# EAGLE schematic Schematic_rtpMIDI (EAGLE 7.6.0)
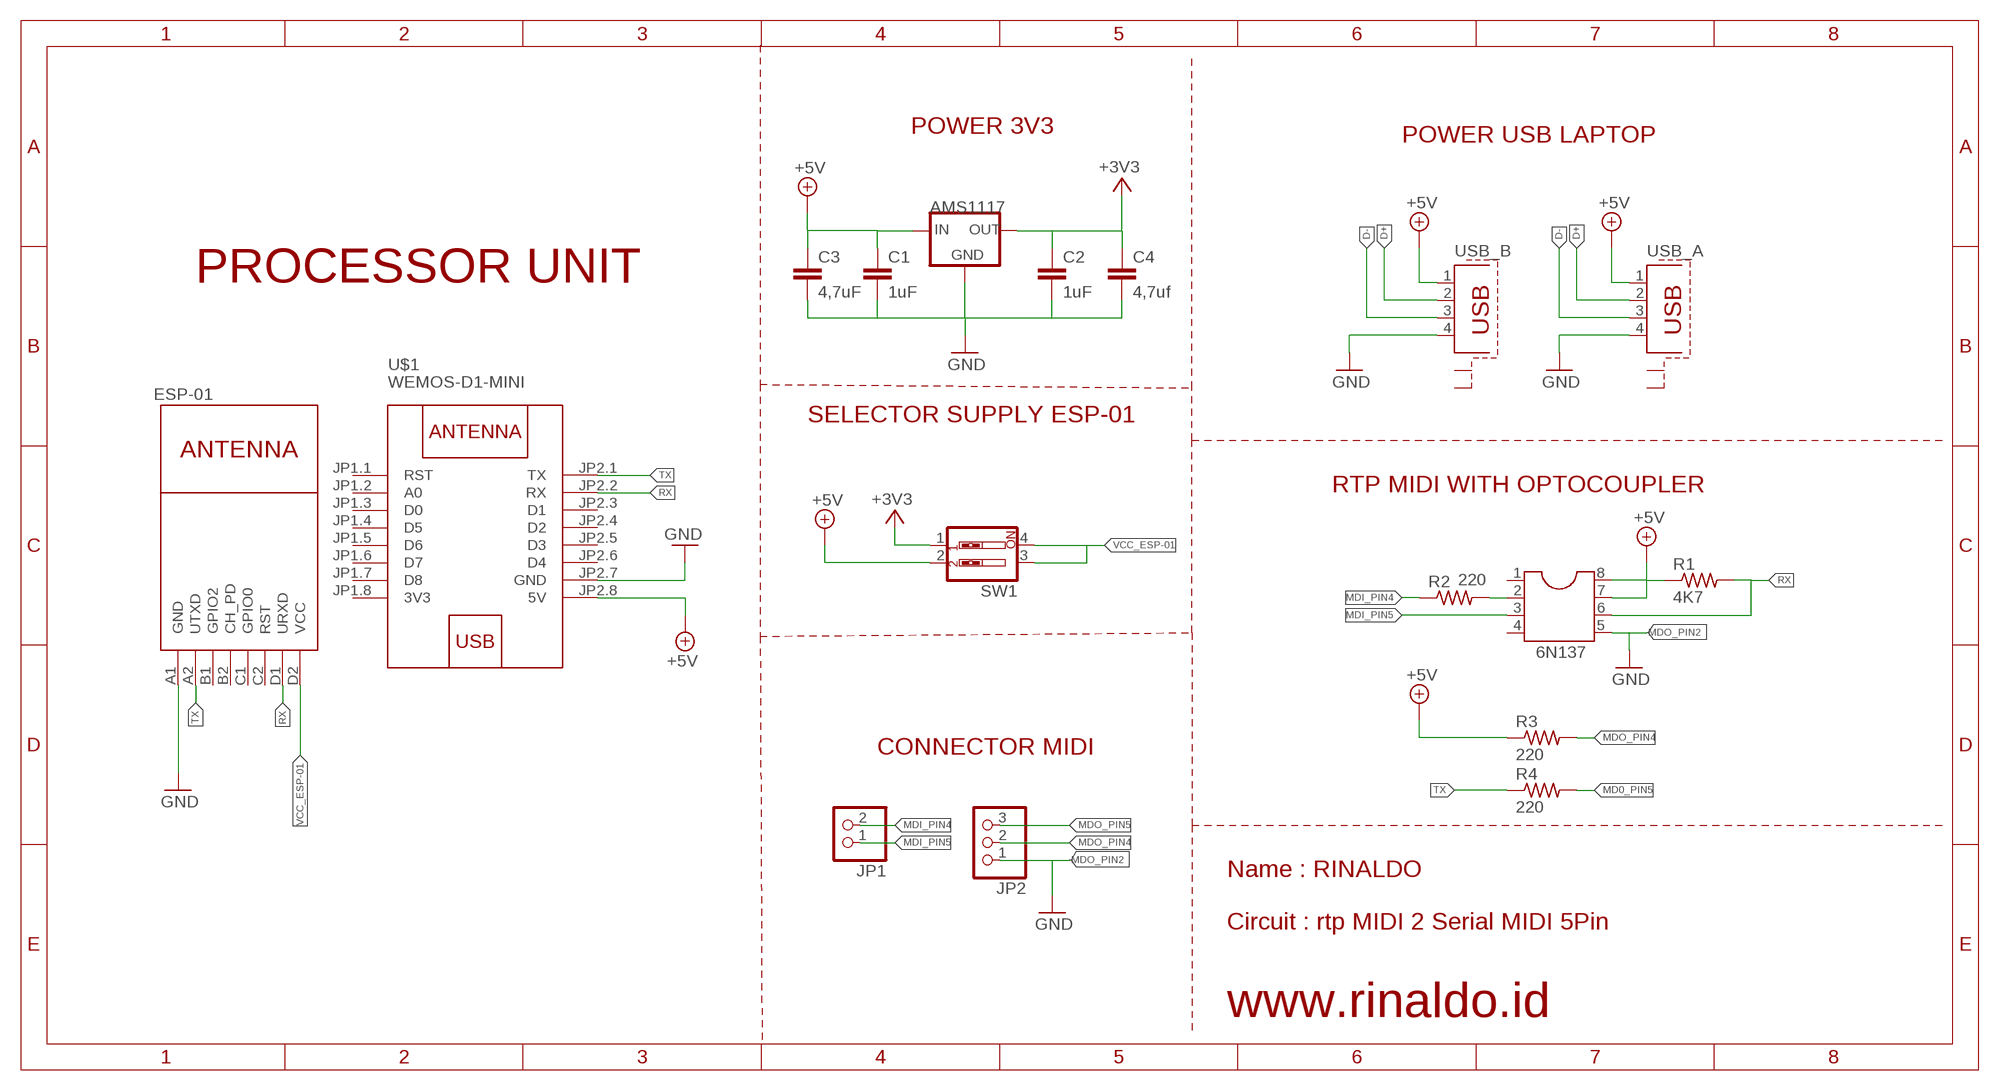
[diagram p0: schematic, sheet 1]

## Parts
6N137  DIL8S  [SOCKET-08]
AMS1117  V_REG_LD1117VXXLD1117-SMD  [SOT223]
C1  1uF  C-EUC0805  [C0805]
C2  1uF  C-EUC0805  [C0805]
C3  4,7uF  C-EUC0805  [C0805]
C4  4,7uf  C-EUC0805  [C0805]
ESP-01  WIRELESS-WIFI-ESP-01  [WIRELESS-WIFI-ESP-01]
JP1  PINHD-1X2  [1X02]
JP2  PINHD-1X3  [1X03]
R1  4K7  R-US_M0805  [M0805]
R2  220  R-US_M0805  [M0805]
R3  220  R-US_M0805  [M0805]
R4  220  R-US_M0805  [M0805]
SW1  SW_DIP-2  [EDG-02]
U$1  WEMOS-D1-MINI  [WEMOS-D1-MINI]
USB_A  PN87520-S  [PN87520-S]
USB_B  PN61729-S  [PN61729-S]

## Nets
+3V3: AMS1117.2(OUT) C2.1 C4.1 SW1.1
+5V: 6N137.7 6N137.8 AMS1117.3(IN) C1.1 C3.1 R1.1 R3.1 SW1.2 U$1.JP2.8(5V) USB_A.1 USB_B.1
D+: USB_A.2 USB_B.2
D-: USB_A.3 USB_B.3
GND: 6N137.5 AMS1117.1(GND) C1.2 C2.2 C3.2 C4.2 ESP-01.A1(GND) JP2.1 U$1.JP2.7(GND) USB_A.4 USB_B.4
MD0_PIN5: R4.2
MDI_PIN4: JP1.2 R2.1
MDI_PIN5: 6N137.3 JP1.1
MDO_PIN4: JP2.2 R3.2
MDO_PIN5: JP2.3
N$1: 6N137.2 R2.2
RX: 6N137.6 ESP-01.D1(URXD) R1.2 U$1.JP2.2(RX)
TX: ESP-01.A2(UTXD) R4.1 U$1.JP2.1(TX)
VCC_ESP-01: ESP-01.D2(VCC) SW1.3 SW1.4
Unconnected: 6N137.1 6N137.4 ESP-01.B1(GPIO2) ESP-01.B2(CH_PD) ESP-01.C1(GPIO0) ESP-01.C2(RST) U$1.JP1.1(RST) U$1.JP1.2(A0) U$1.JP1.3(D0) U$1.JP1.4(D5) U$1.JP1.5(D6) U$1.JP1.6(D7) U$1.JP1.7(D8) U$1.JP2.3(D1) U$1.JP2.4(D2) U$1.JP2.5(D3) U$1.JP2.6(D4) USB_A.S1 USB_A.S2 USB_B.S1 USB_B.S2

## Notes on the sheet
- POWER 3V3
- POWER USB LAPTOP
- PROCESSOR UNIT
- SELECTOR SUPPLY ESP-01
- RTP MIDI WITH OPTOCOUPLER
- MDO_PIN2
- CONNECTOR MIDI
- MDO_PIN2
- Name : RINALDO
  
  Circuit : rtp MIDI 2 Serial MIDI 5Pin
- www.rinaldo.id

## Power pins joined to a net without a drawn wire
3V3: U$1.JP1.8(3V3)

## Library data of the parts
6N137 = ic-package:DIL8: Dual In Line / Socket
AMS1117 = SparkFun-IC-Power:V_REG_LD1117VXX: LD1117VXX voltage regulator. We carry the 3.3V version (COM-00526) in TO-220 package.; PROD_ID: VREG-13917
C1-C4 = rcl:C-EU: CAPACITOR, European symbol
ESP-01 = diy-modules(1):WIRELESS-WIFI-ESP-01: Wireless Wi-Fi ESP-01 Module based on ESP8266 chip Click here to find device on ebay.com <http://www.ebay.com/sch/esp8266+esp+01+transceiver>
JP1 = pinhead:PINHD-1X2: PIN HEADER
JP2 = pinhead:PINHD-1X3: PIN HEADER
R1-R4 = rcl:R-US_: RESISTOR, American symbol
SW1 = special:SW_DIP-2: DIP SWITCH
U$1 = diy-modules(1):WEMOS-D1-MINI: WEMOS D1 mini: Mini Wi-Fi Board based on ESP-8266 device More details can be found here: https://www.wemos.cc/product/d1-mini.html Click here to find device on ebay.com <http://www.ebay.com/sch/wemos+d1+mini+nodemcu>
USB_A = con-berg:PN87520-S; OC_FARNELL: unknown; OC_NEWARK: unknown
USB_B = con-berg:PN61729-S: BERG USB connector; OC_FARNELL: unknown; OC_NEWARK: unknown